# Altium schematic sheet ST-LINK.SchDoc (part 1 of 2)
size 420 x 297 mm; Date: 22.03.2024; ApprovedBy: Arda B.; CheckedBy: Arda B.; DrawnBy: Arda Bozkurt; Revision: 001; SheetNumber: 6; SheetTotal: 9; Size: A3; Departmant: HDD; DOC_NO_ASSY_: __; Time: 22.03.2024
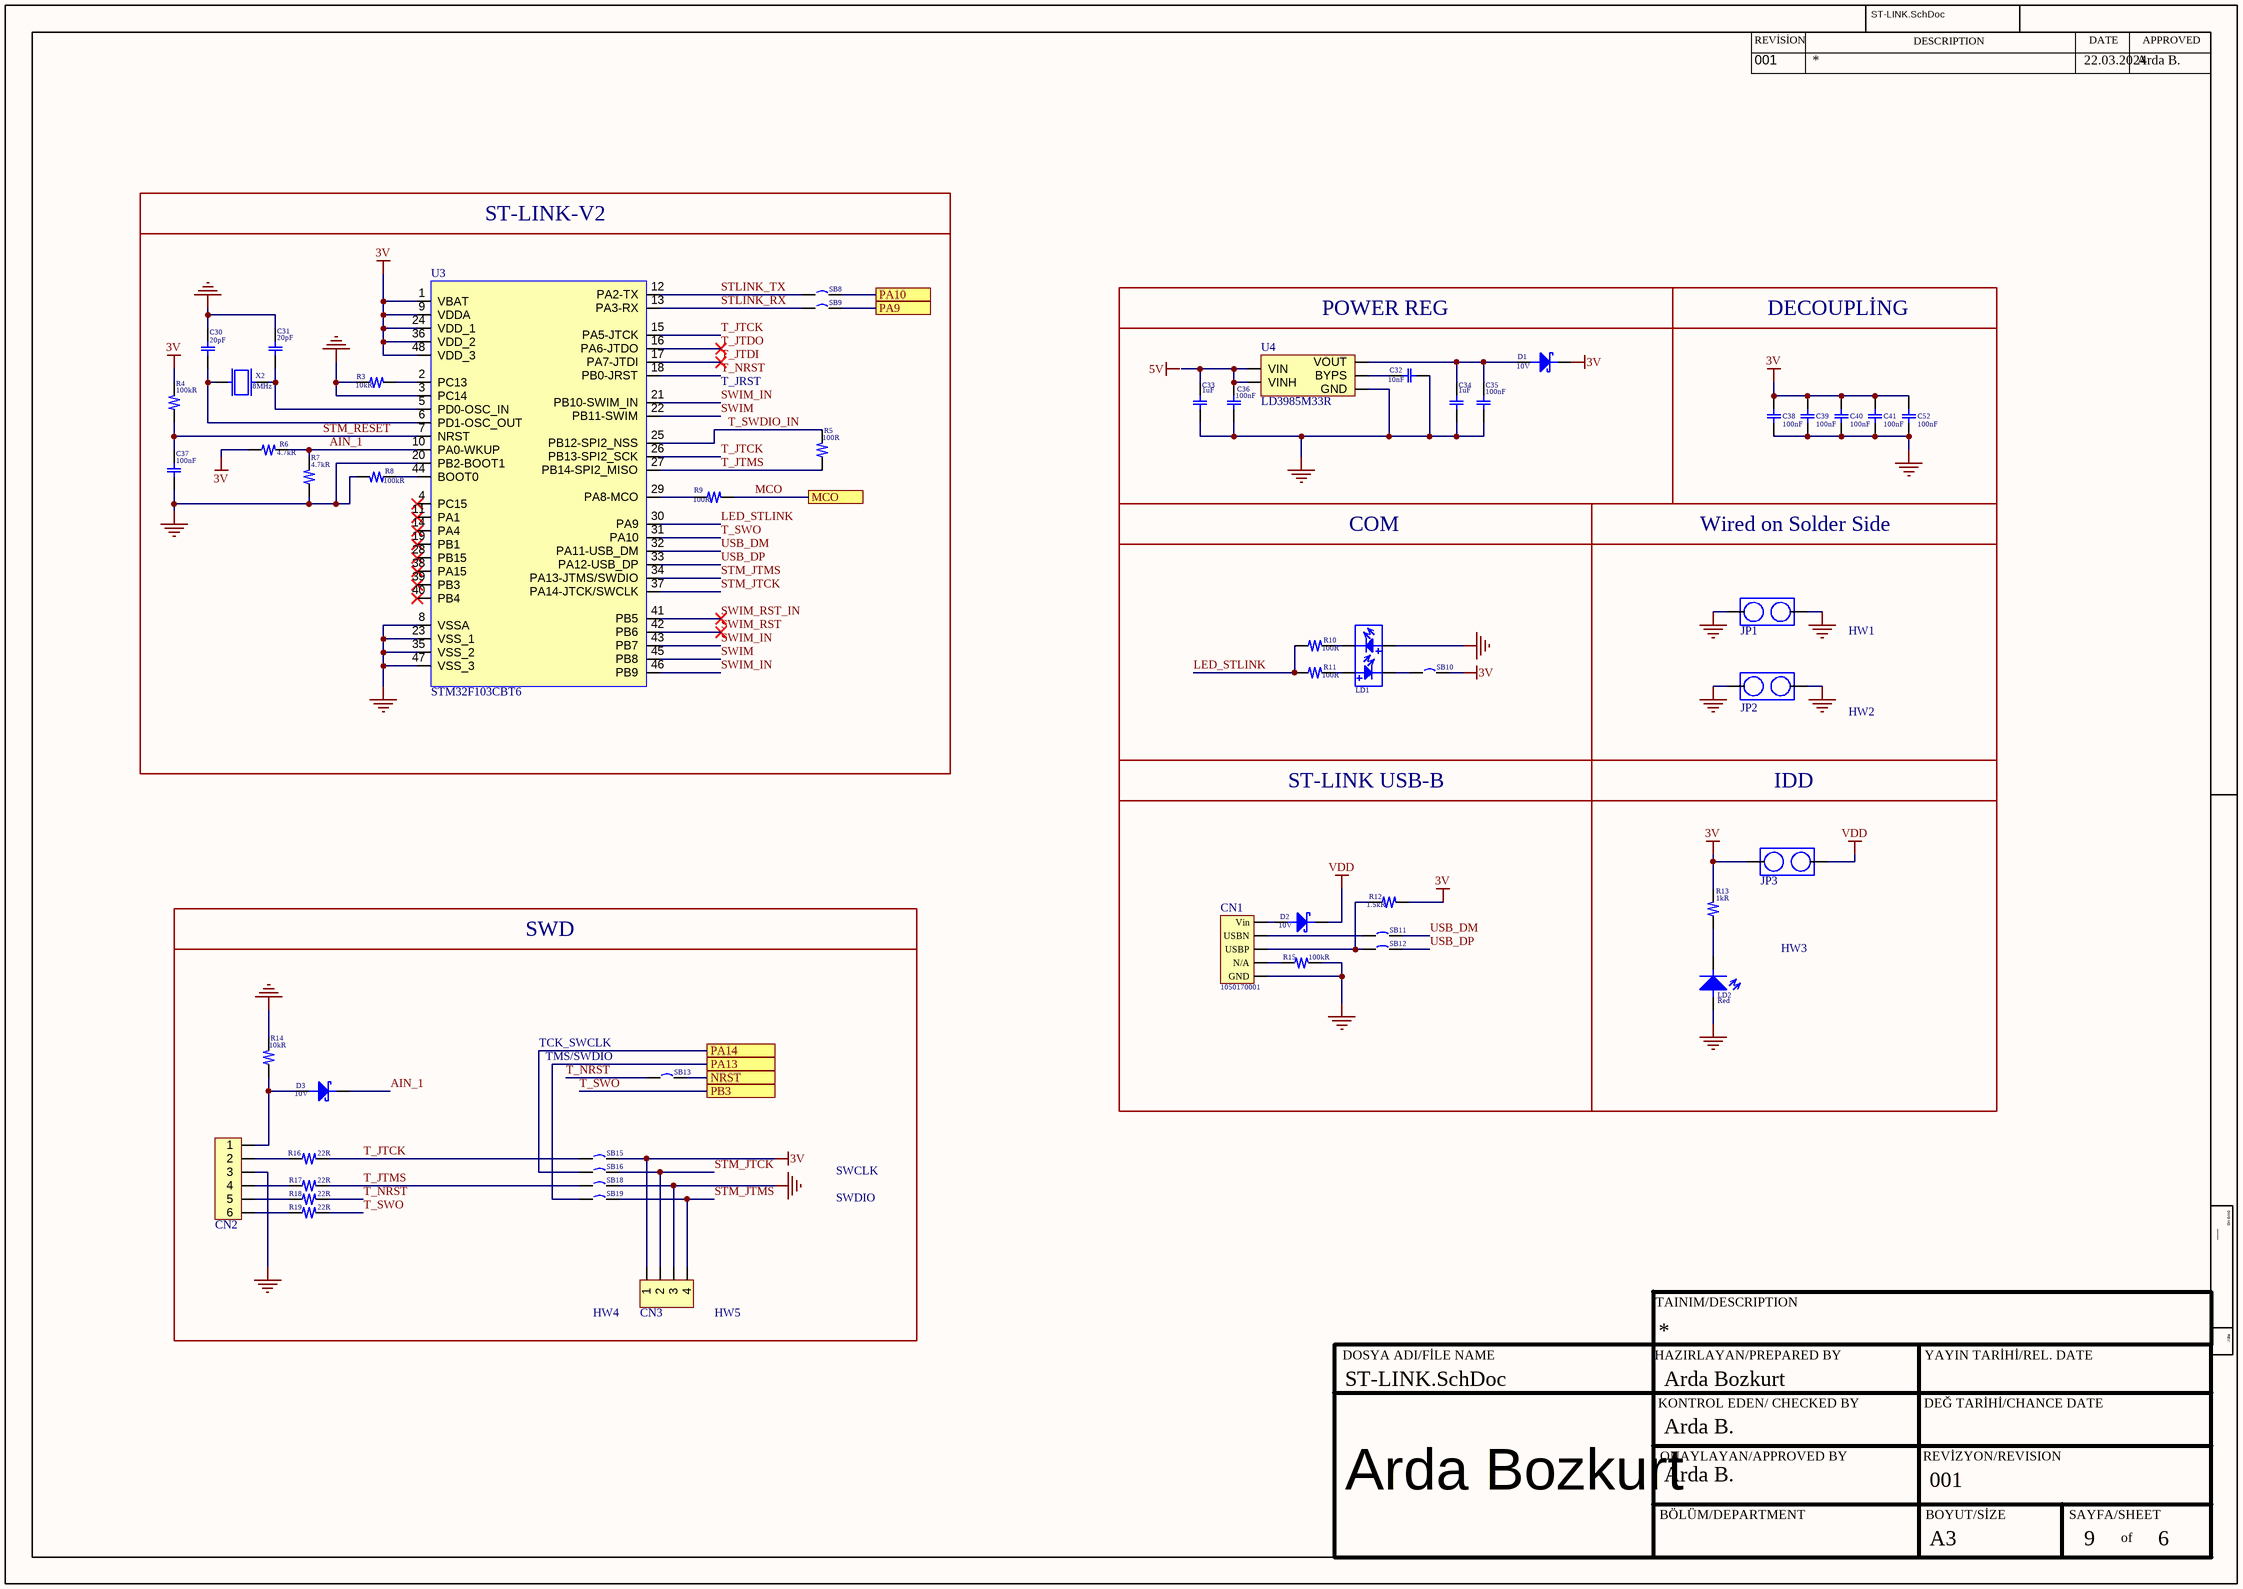
[diagram p0: ST-LINK.SchDoc]

## Parts
C30  value 20pF  [CAP-0402]  (hidden comment: CC0402JRNPO9BN200)
C31  value 20pF  [CAP-0402]  (hidden comment: CC0402JRNPO9BN200)
C32  value 10nF  [CAP-0603]  (hidden comment: CC0603KRX7R9BB103)
C33  value 1uF  [CAP-0603]  (hidden comment: CC0603KRX5R8BB105)
C34  value 1uF  [CAP-0603]  (hidden comment: CC0603KRX5R8BB105)
C35  value 100nF  [CAP-0402]  (hidden comment: CC0402KRX7R7BB104)
C36  value 100nF  [CAP-0402]  (hidden comment: CC0402KRX7R7BB104)
C37  value 100nF  [CAP-0402]  (hidden comment: CC0402KRX7R7BB104)
C38  value 100nF  [CAP-0402]  (hidden comment: CC0402KRX7R7BB104)
C39  value 100nF  [CAP-0402]  (hidden comment: CC0402KRX7R7BB104)
C40  value 100nF  [CAP-0402]  (hidden comment: CC0402KRX7R7BB104)
C41  value 100nF  [CAP-0402]  (hidden comment: CC0402KRX7R7BB104)
C52  value 100nF  [CAP-0402]  (hidden comment: CC0402KRX7R7BB104)
CN1  1050170001  [USB MİCRO B]
CN2  TS-106-G-A  [CONN-6POS]  (value not drawn)
CN3  61300411121  [CONN-4POS]  (value not drawn)
D1  Peak Voltage: 10V  [SOD-323]  (hidden comment: BAT60JFILM)
D2  Peak Voltage: 10V  [SOD-323]  (hidden comment: BAT60JFILM)
D3  Peak Voltage: 10V  [SOD-323]  (hidden comment: BAT60JFILM)
HW1  MNT-101-BK-G  [SHUNT]  (value not drawn)
HW2  MNT-101-BK-G  [SHUNT]  (value not drawn)
HW3  MNT-101-BK-G  [SHUNT]  (value not drawn)
HW4  MNT-101-BK-G  [SHUNT]  (value not drawn)
HW5  MNT-101-BK-G  [SHUNT]  (value not drawn)
JP1  61300211121  [CONN-2PİNS]  (value not drawn)
JP2  61300211121  [CONN-2PİNS]  (value not drawn)
JP3  61300211121  [CONN-2PİNS]  (value not drawn)
LD1  67-22SURSYGC/S530-A2/TR8  [LED-RED-GREEN-SMD]  (value not drawn)
LD2  Color: Red  [LED-RED-0603]  (hidden comment: 150060RS75000)
R3  value 10kR  [RES-0402]  (hidden comment: RC0402FR-0710KL)
R4  value 100kR  [RES-0402]  (hidden comment: RC0402FR-07100KL)
R5  value 100R  [RES-0402]  (hidden comment: RC0402FR-07100RL)
R6  value 4.7kR  [RES-0402]  (hidden comment: RC0402FR-074K7L)
R7  value 4.7kR  [RES-0402]  (hidden comment: RC0402FR-074K7L)
R8  value 100kR  [RES-0402]  (hidden comment: RC0402FR-07100KL)
R9  value 100R  [RES-0402]  (hidden comment: RC0402FR-07100RL)
R10  value 100R  [RES-0402]  (hidden comment: RC0402FR-07100RL)
R11  value 100R  [RES-0402]  (hidden comment: RC0402FR-07100RL)
R12  value 1.5kR  [RES-0402]  (hidden comment: RC0402FR-071K5L)
R13  value 1kR  [RES-0402]  (hidden comment: RC0402FR-071KL)
R14  value 10kR  [RES-0402]  (hidden comment: RC0402FR-0710KL)
R15  value 100kR  [RES-0402]  (hidden comment: RC0402FR-07100KL)
R16  value 22R  [RES-0603]  (hidden comment: RC0603FR-0722RL)
R17  value 22R  [RES-0603]  (hidden comment: RC0603FR-0722RL)
R18  value 22R  [RES-0603]  (hidden comment: RC0603FR-0722RL)
R19  value 22R  [RES-0603]  (hidden comment: RC0603FR-0722RL)
SB8  RC0402JR-070RL  [RES-0402]  (value not drawn)
SB9  RC0402JR-070RL  [RES-0402]  (value not drawn)
SB10  RC0402JR-070RL  [RES-0402]  (value not drawn)
SB11  RC0402JR-070RL  [RES-0402]  (value not drawn)
SB12  RC0402JR-070RL  [RES-0402]  (value not drawn)
SB13  RC0402JR-070RL  [RES-0402]  (value not drawn)
SB15  RC0402JR-070RL  [RES-0402]  (value not drawn)
SB16  RC0402JR-070RL  [RES-0402]  (value not drawn)
SB18  RC0402JR-070RL  [RES-0402]  (value not drawn)
SB19  RC0402JR-070RL  [RES-0402]  (value not drawn)
U3  STM32F103CBT6  [LQFP-48]
U4  LD3985M33R  [SOT23-5L]
X2  Frequency: 8MHz  [HC-49US]  (hidden comment: H1OED8K5SC-112YXC-8M)

## Ports
MCO (see TOP[3B]), NRST (see TOP[3B]), PA9 (see TOP[3B]), PA10 (see TOP[3B]), PA13 (see TOP[3B], Micro Controller[4A]), PA14 (see TOP[3B]), PB3 (see TOP[3B])

## Nets
3V: C38.2 C39.2 C40.2 C41.2 C52.2 CN3.1 D1.1 JP3.1 R4.2 R6.1 R12.2 R13.2 SB10.2 SB15.2 U3.1(VBAT) U3.9(VDDA) U3.24(VDD_1) U3.36(VDD_2) U3.48(VDD_3)
GND: C30.2 C31.2 C32.2 C33.1 C34.1 C35.1 C36.1 C37.1 C38.1 C39.1 C40.1 C41.1 C52.1 CN1.5(GND) CN2.3 CN3.3 JP1.1 JP1.2 JP2.1 JP2.2 LD1.1 LD2.2 R3.1 R7.1 R8.2 R14.2 R15.2 SB18.2 U3.3(PC14) U3.8(VSSA) U3.20(PB2-BOOT1) U3.23(VSS_1) U3.35(VSS_2) U3.47(VSS_3) U4.2(GND)
VDD: D2.1 JP3.2
AIN_1: D3.1 R6.2 R7.2 U3.10(PA0-WKUP)
LED_STLINK: R10.1 R11.1 U3.30(PA9)
MCO: R9.2 ; port MCO
NRST: SB13.2 ; port NRST
PA9: SB9.2 ; port PA9
PA10: SB8.2 ; port PA10
PA13: SB19.1 ; port PA13
PA14: SB16.1 ; port PA14
STLINK_RX: SB9.1 U3.13(PA3-RX)
STLINK_TX: SB8.1 U3.12(PA2-TX)
STM_JTCK: CN3.2 SB16.2 U3.37(PA14-JTCK/SWCLK)
STM_JTMS: CN3.4 SB19.2 U3.34(PA13-JTMS/SWDIO)
STM_RESET: C37.2 R4.1 U3.7(NRST)
SWIM: U3.22(PB11-SWIM) U3.45(PB8)
SWIM_IN: U3.21(PB10-SWIM_IN) U3.43(PB7) U3.46(PB9)
SWIM_RST: U3.42(PB6)
SWIM_RST_IN: U3.41(PB5)
T_JTCK: R16.2 SB15.1 U3.15(PA5-JTCK) U3.26(PB13-SPI2_SCK)
T_JTDI: U3.17(PA7-JTDI)
T_JTDO: U3.16(PA6-JTDO)
T_JTMS: R5.1 R17.2 SB18.1 U3.27(PB14-SPI2_MISO)
T_NRST: R18.2 SB13.1 U3.18(PB0-JRST)
T_SWDIO_IN: R5.2 U3.25(PB12-SPI2_NSS)
T_SWO: R19.2 U3.31(PA10) ; port PB3
USB_DM: SB11.2 U3.32(PA11-USB_DM)
USB_DP: SB12.2 U3.33(PA12-USB_DP)
NetC30_1: C30.1 U3.6(PD1-OSC_OUT) X2.1
NetC31_1: C31.1 U3.5(PD0-OSC_IN) X2.2
NetC32_1: C32.1 U4.4(BYPS)
NetC33_2: C33.2 C36.2 U4.1(VIN) U4.3(VINH)
NetC34_2: C34.2 C35.2 D1.2 U4.5(VOUT)
NetCN1_1: CN1.1(Vin) D2.2
NetCN1_2: CN1.2(USBN) SB11.1
NetCN1_3: CN1.3(USBP) R12.1 SB12.1
NetCN1_4: CN1.4(N/A) R15.1
NetCN2_1: CN2.1 D3.2 R14.1
NetCN2_2: CN2.2 R16.1
NetCN2_4: CN2.4 R17.1
NetCN2_5: CN2.5 R18.1
NetCN2_6: CN2.6 R19.1
NetLD1_2: LD1.2 R10.2
NetLD1_3: LD1.3 R11.2
NetLD1_4: LD1.4 SB10.1
NetLD2_1: LD2.1 R13.1
NetR3_2: R3.2 U3.2(PC13)
NetR8_1: R8.1 U3.44(BOOT0)
NetR9_1: R9.1 U3.29(PA8-MCO)

Not connected (* = marked no-connect by the designer): U3 4(PC15)* 11(PA1)* 14(PA4)* 19(PB1)* 28(PB15)* 38(PA15)* 39(PB3)* 40(PB4)*

## Notes on the sheet
- ST-LINK-V2
- POWER REG
- DECOUPLİNG
- T_JRST
- COM
- Wired on Solder Side
- ST-LINK USB-B
- IDD
- SWD
- TCK_SWCLK
- TMS/SWDIO
- SWCLK
- SWDIO
- Labels drawn without touching a wire or pin: 5V
- REVİSİON
- DESCRIPTION
- DATE
- APPROVED
- DWG NO:
- TAINIM/DESCRIPTION
- REV:
- DOSYA ADI/FİLE NAME
- HAZIRLAYAN/PREPARED BY
- KONTROL EDEN/ CHECKED BY
- YAYIN TARİHİ/REL. DATE
- DEĞ TARİHİ/CHANCE DATE
- ONAYLAYAN/APPROVED BY
- REVİZYON/REVISION
- Arda Bozkurt
- BÖLÜM/DEPARTMENT
- BOYUT/SİZE
- SAYFA/SHEET
- of